# Altium schematic sheet Figure.SchDoc: SheetTitle
size A
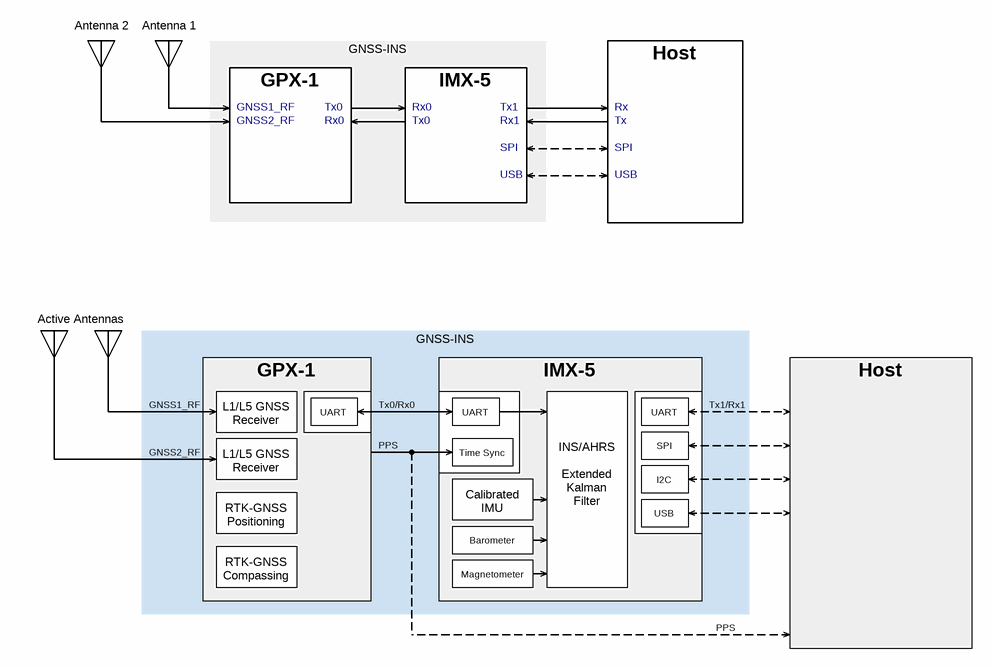
[diagram p0: Figure.SchDoc]

## Notes on the sheet
- Antenna 2
- Antenna 1
- GNSS1_RF
- GNSS2_RF
- Tx0
- Rx0
- Tx1
- Rx1
- Tx
- Rx
- GPX-1
- IMX-5
- SPI
- USB
- GNSS-INS
- Host
- Active Antennas
- L1/L5 GNSS Receiver
- UART
- PPS
- Tx0/Rx0
- Time Sync
- Tx1/Rx1
- RTK-GNSS
  Positioning
- Calibrated
  IMU
- I2C
- RTK-GNSS
  Compassing
- Barometer
- Magnetometer
- INS/AHRS
  Extended
  Kalman
  Filter
- Date
- Sheet
- Project
- Time
- PCB
- Assy
- of
- Size
- A
- File